# Altium project dory-x.PrjPcb (part 12 of 12)
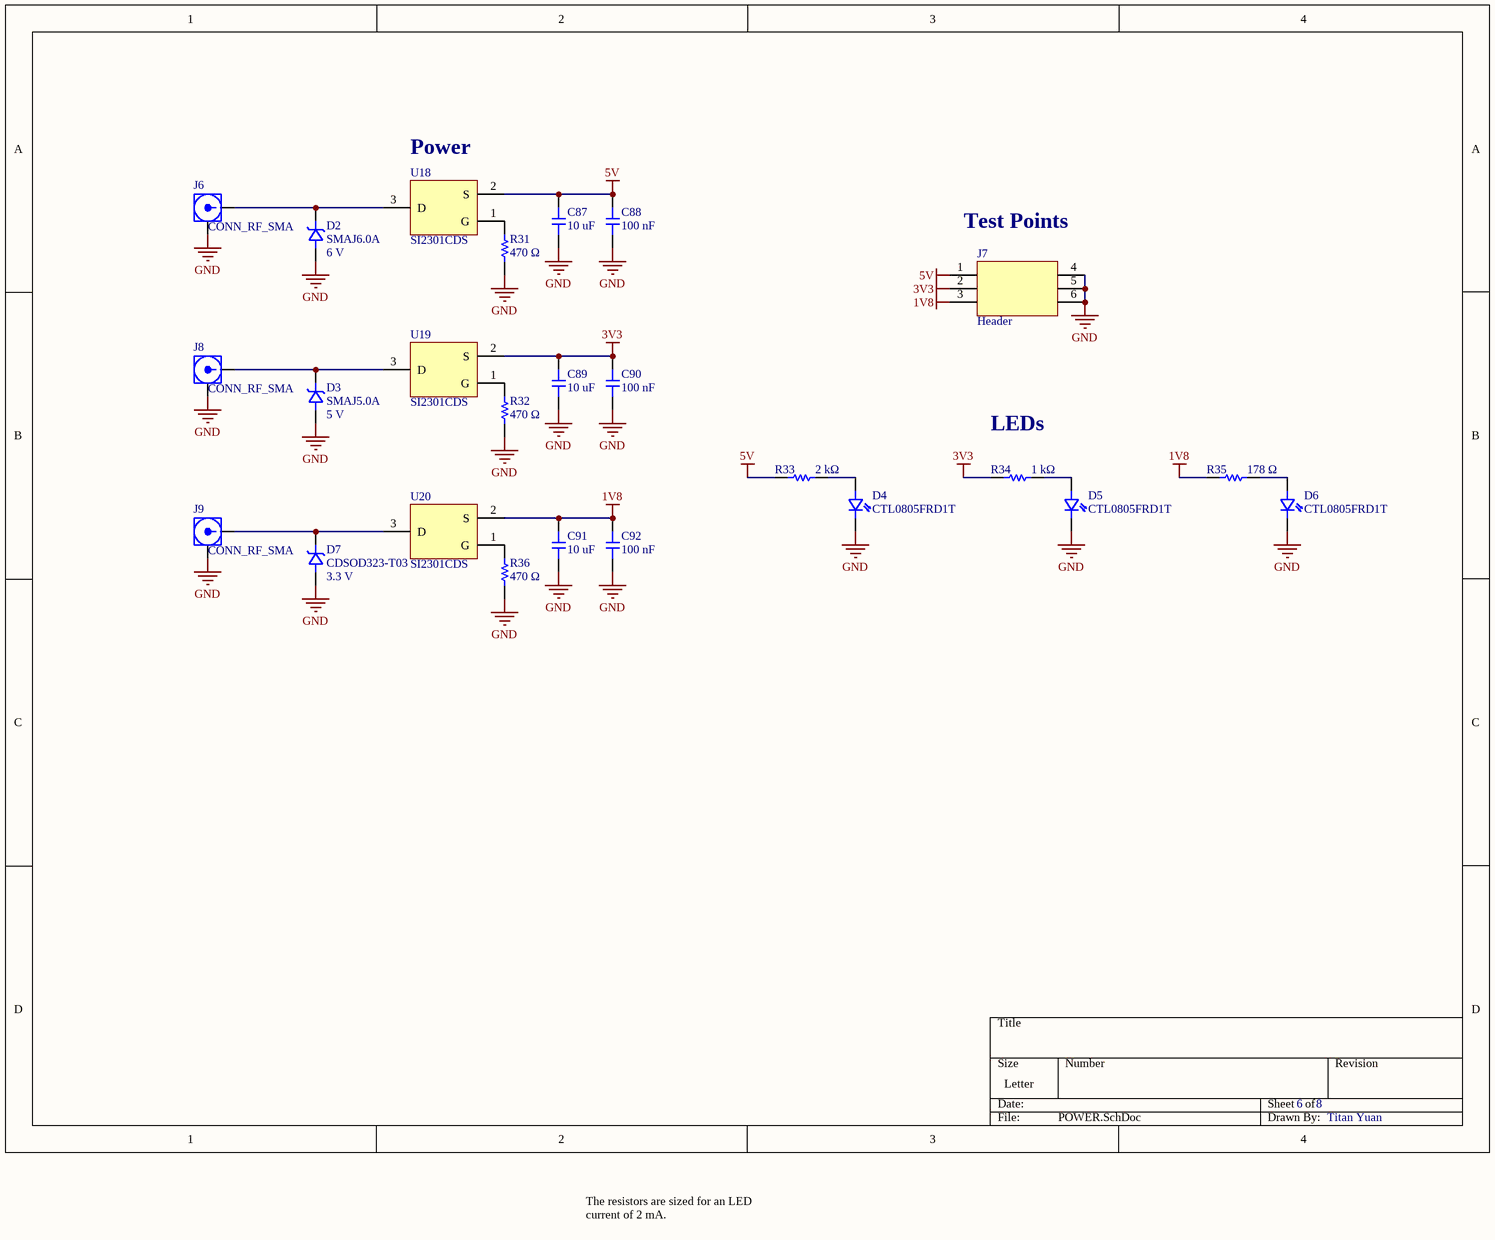
[diagram p18: POWER.SchDoc]

## Sheet POWER.SchDoc (continued)

### Library data of the parts (continued)
R35 = RES: Res Thick Film 0603 178 Ohm 1% 0.1W(1/10W) ±100ppm/C Pad SMD T/R; Manufacturer: Yageo; Manufacturer Part Number: RC0603FR-07178RL; Power Dissipation: 100mW; Value: 178Ω; Temperature Coefficient: 100ppm/°C; Voltage Rating: 75V; Voltage Rating (DC): 50V; Tolerance: 1%; Power Rating: *; Package Size: 0603; Supplier: DigiKey; Supplier Part Number: 311-178HRCT-ND; RoHS: Compliant; Category: Chip SMD Resistors; Stock: 269039; Pricing: 1=0.1, 10=0.006, 25=0.0056, 50=0.0052 (USD); Case/Package: 0603; Case Code (Imperial): 0603; China RoHS: Non-Compliant; Composition: Thick Film; Depth: 800µm; Height: 450µm; Lead Free: Lead Free; Length: 1.6mm; Lifecycle Status: Production; Max Operating Temperature: 155°C; Military Standard: Not; Min Operating Temperature: -55°C; Mounting Technology: Surface Mount; Number of Terminals: 2; Packaging: Tape & Reel; REACH SVHC: Yes; Schedule B: 8533210045, 8533210045|8533210045|8533210045|8533210045|8533210045; Termination: SMD/SMT; Width: 800µm; Working Voltage: 75V; ComponentLink1URL: https://datasheet.octopart.com:443/RC0603FR-07178RL-Yageo-datasheet-175887523.pdf?src-supplier=Newark; ComponentLink1Description: https://datasheet.octopart.com:443/RC0603FR-07178RL-Yageo-datasheet-175887523.pdf?src-supplier=Newark; ComponentLink2URL: https://datasheet.octopart.com:443/RC0603FR-07178RL-Yageo-datasheet-103092701.pdf?src-supplier=Upverter; ComponentLink2Description: https://datasheet.octopart.com:443/RC0603FR-07178RL-Yageo-datasheet-103092701.pdf?src-supplier=Upverter; ComponentLink3URL: https://datasheet.octopart.com:443/RC0603FR-07178RL-Yageo-Group-datasheet-176638170.pdf?src-supplier=Future+Electronics; ComponentLink3Description: https://datasheet.octopart.com:443/RC0603FR-07178RL-Yageo-Group-datasheet-176638170.pdf?src-supplier=Future+Electronics; ComponentLink4URL: https://datasheet.octopart.com:443/RC0603FR-07178RL-Yageo-datasheet-164759695.pdf?src-supplier=Future+Electronics; ComponentLink4Description: https://datasheet.octopart.com:443/RC0603FR-07178RL-Yageo-datasheet-164759695.pdf?src-supplier=Future+Electronics; ComponentLink5URL: https://datasheet.octopart.com:443/RC0603FR-07178RL-Yageo-datasheet-137700087.pdf?src-supplier=Future+Electronics; ComponentLink5Description: https://datasheet.octopart.com:443/RC0603FR-07178RL-Yageo-datasheet-137700087.pdf?src-supplier=Future+Electronics; ComponentLink6URL: https://datasheet.octopart.com:443/RC0603FR-07178RL-Yageo-datasheet-101672632.pdf?src-supplier=Future+Electronics; ComponentLink6Description: https://datasheet.octopart.com:443/RC0603FR-07178RL-Yageo-datasheet-101672632.pdf?src-supplier=Future+Electronics; ComponentLink7URL: https://datasheet.octopart.com:443/RC0603FR-07178RL-Yageo-datasheet-15599030.pdf?src-supplier=Future+Electronics; ComponentLink7Description: https://datasheet.octopart.com:443/RC0603FR-07178RL-Yageo-datasheet-15599030.pdf?src-supplier=Future+Electronics; ComponentLink8URL: https://datasheet.octopart.com:443/RC0603FR-07178RL-Yageo-datasheet-12596169.pdf?src-supplier=Future+Electronics; ComponentLink8Description: https://datasheet.octopart.com:443/RC0603FR-07178RL-Yageo-datasheet-12596169.pdf?src-supplier=Future+Electronics; ComponentLink9URL: https://datasheet.octopart.com:443/RC0603FR-07178RL-Yageo-datasheet-8328172.pdf?src-supplier=Future+Electronics; ComponentLink9Description: https://datasheet.octopart.com:443/RC0603FR-07178RL-Yageo-datasheet-8328172.pdf?src-supplier=Future+Electronics; ComponentLink10URL: https://datasheet.octopart.com:443/RC0603FR-07178RL-Yageo-datasheet-148775077.pdf?src-supplier=TME; ComponentLink10Description: https://datasheet.octopart.com:443/RC0603FR-07178RL-Yageo-datasheet-148775077.pdf?src-supplier=TME; ComponentLink11URL: https://datasheet.octopart.com/RC0603FR-07178RL-Yageo-datasheet-73766026.pdf; ComponentLink11Description: https://datasheet.octopart.com/RC0603FR-07178RL-Yageo-datasheet-73766026.pdf; ComponentLink12URL: https://datasheet.octopart.com:443/RC0603FR-07178RL-Yageo-datasheet-118562.pdf?src-supplier=DigiKey; ComponentLink12Description: https://datasheet.octopart.com:443/RC0603FR-07178RL-Yageo-datasheet-118562.pdf?src-supplier=DigiKey; ComponentLink13URL: http://sigma.octopart.com:80/conflict_mineral_statement/Yageo-company-3.pdf?src-supplier=Compliance+Statements; ComponentLink13Description: http://sigma.octopart.com:80/conflict_mineral_statement/Yageo-company-3.pdf?src-supplier=Compliance+Statements; ComponentLink14URL: http://sigma.octopart.com:80/rohs_statement/Yageo-company-2.pdf?src-supplier=Compliance+Statements; ComponentLink14Description: http://sigma.octopart.com:80/rohs_statement/Yageo-company-2.pdf?src-supplier=Compliance+Statements
U18-U20 = SI2301CDS: P-ch Mosfet SOT-23 20V 112MOHM @ 4.5V - Lead(pb) And Halogen Free; Manufacturer: Vishay Siliconix; Manufacturer Part Number: SI2301CDS-T1-GE3; Continuous Drain Current (ID): 3.1A; Drain to Source Breakdown Voltage: -20V; Drain to Source Resistance: 112mΩ; Element Configuration: Single; Fall Time: 35ns; Gate to Source Voltage (Vgs): 8V; Input Capacitance: 405pF; Max Junction Temperature (Tj): 150°C; Max Power Dissipation: 1.6W; Nominal Vgs: -400mV; Number of Channels: 1; Value: 112mΩ; Threshold Voltage: -1V; Turn-Off Delay Time: 30ns; Turn-On Delay Time: 11ns; Supplier: DigiKey; Supplier Part Number: SI2301CDS-T1-GE3CT-ND; RoHS: Compliant; Category: MOSFETs; Stock: 103168; Pricing: 1=0.69, 10=0.425, 100=0.2731, 500=0.20736, 1000=0.18615, 3000=0.15917, 6000=0.14558, 9000=0.13865, 15000=0.13086, 21000=0.12625, 30000=0.12177, 75000=0.11875 (USD); Case/Package: SOT-23; China RoHS: Compliant; Contact Plating: Tin; Country of Origin: Mainland China; Drain to Source Voltage (Vdss): -20V; Export Control Classification Number (ECCN) Code: EAR99; Height: 1.12mm; Introduction Date: 2008-07-29; Lead Free: Lead Free; Length: 3.04mm; Lifecycle Status: NRND; Max Operating Temperature: 150°C; Min Breakdown Voltage: 20V; Min Operating Temperature: -55°C; Mounting Technology: Surface Mount; Number of Elements: 1; Pins: 3; Number of Terminals: 3; Packaging: Cut Tape; Power Dissipation: 1.6W; Radiation Hardening: No; Rds On Max: 112mΩ; REACH SVHC: Yes; Rise Time: 35ns; Schedule B: 8541210080, 8541210080|8541210080, 8541210080|8541210080|8541210080, 8541210080|8541210080|8541210080|8541210080; Weight: 1.437803g; Width: 1.4mm; ComponentLink1URL: https://datasheet.octopart.com:443/SI2301CDS-T1-GE3-Vishay-datasheet-181471154.pdf?src-supplier=Newark; ComponentLink1Description: https://datasheet.octopart.com:443/SI2301CDS-T1-GE3-Vishay-datasheet-181471154.pdf?src-supplier=Newark; ComponentLink2URL: https://datasheet.octopart.com:443/SI2301CDS-T1-GE3-Vishay-datasheet-12510940.pdf?src-supplier=Newark; ComponentLink2Description: https://datasheet.octopart.com:443/SI2301CDS-T1-GE3-Vishay-datasheet-12510940.pdf?src-supplier=Newark; ComponentLink3URL: https://datasheet.octopart.com:443/SI2301CDS-T1-GE3-Vishay-datasheet-8434571.pdf?src-supplier=Newark; ComponentLink3Description: https://datasheet.octopart.com:443/SI2301CDS-T1-GE3-Vishay-datasheet-8434571.pdf?src-supplier=Newark; ComponentLink4URL: https://datasheet.octopart.com:443/SI2301CDS-T1-GE3-Vishay-datasheet-41341312.pdf?src-supplier=Newark; ComponentLink4Description: https://datasheet.octopart.com:443/SI2301CDS-T1-GE3-Vishay-datasheet-41341312.pdf?src-supplier=Newark; ComponentLink5URL: https://datasheet.octopart.com:443/SI2301CDS-T1-GE3-Vishay-datasheet-62318581.pdf?src-supplier=element14+APAC; ComponentLink5Description: https://datasheet.octopart.com:443/SI2301CDS-T1-GE3-Vishay-datasheet-62318581.pdf?src-supplier=element14+APAC; ComponentLink6URL: https://datasheet.octopart.com:443/SI2301CDS-T1-GE3-Vishay-datasheet-41195220.pdf?src-supplier=element14+APAC; ComponentLink6Description: https://datasheet.octopart.com:443/SI2301CDS-T1-GE3-Vishay-datasheet-41195220.pdf?src-supplier=element14+APAC; ComponentLink7URL: https://datasheet.octopart.com:443/SI2301CDS-T1-GE3.-Vishay-datasheet-78863653.pdf?src-supplier=element14+APAC; ComponentLink7Description: https://datasheet.octopart.com:443/SI2301CDS-T1-GE3.-Vishay-datasheet-78863653.pdf?src-supplier=element14+APAC; ComponentLink8URL: https://datasheet.octopart.com:443/SI2301CDS-T1-GE3-Vishay-datasheet-21269440.pdf?src-supplier=Farnell; ComponentLink8Description: https://datasheet.octopart.com:443/SI2301CDS-T1-GE3-Vishay-datasheet-21269440.pdf?src-supplier=Farnell; ComponentLink9URL: https://datasheet.octopart.com:443/SI2301CDS-T1-GE3-Vishay-datasheet-165585106.pdf?src-supplier=TME; ComponentLink9Description: https://datasheet.octopart.com:443/SI2301CDS-T1-GE3-Vishay-datasheet-165585106.pdf?src-supplier=TME; ComponentLink10URL: https://datasheet.octopart.com:443/SI2301CDS-T1-GE3-Vishay-datasheet-44060305.pdf?src-supplier=TME; ComponentLink10Description: https://datasheet.octopart.com:443/SI2301CDS-T1-GE3-Vishay-datasheet-44060305.pdf?src-supplier=TME; ComponentLink11URL: https://datasheet.octopart.com:443/SI2301CDS-T1-GE3-Vishay-Siliconix-datasheet-62309529.pdf?src-supplier=RS+(Formerly+Allied+Electronics); ComponentLink11Description: https://datasheet.octopart.com:443/SI2301CDS-T1-GE3-Vishay-Siliconix-datasheet-62309529.pdf?src-supplier=RS+(Formerly+Allied+Electronics); ComponentLink12URL: https://datasheet.octopart.com:443/SI2301CDS-T1-GE3-Vishay-datasheet-14188513.pdf?src-supplier=iiiC; ComponentLink12Description: https://datasheet.octopart.com:443/SI2301CDS-T1-GE3-Vishay-datasheet-14188513.pdf?src-supplier=iiiC; ComponentLink13URL: http://sigma.octopart.com:80/rohs_statement/Vishay-company-15.pdf?src-supplier=Compliance+Statements; ComponentLink13Description: http://sigma.octopart.com:80/rohs_statement/Vishay-company-15.pdf?src-supplier=Compliance+Statements

## Sheet MCU.SchDoc
size Letter; DrawnBy: Titan Yuan; SheetNumber: 7; SheetTotal: 8
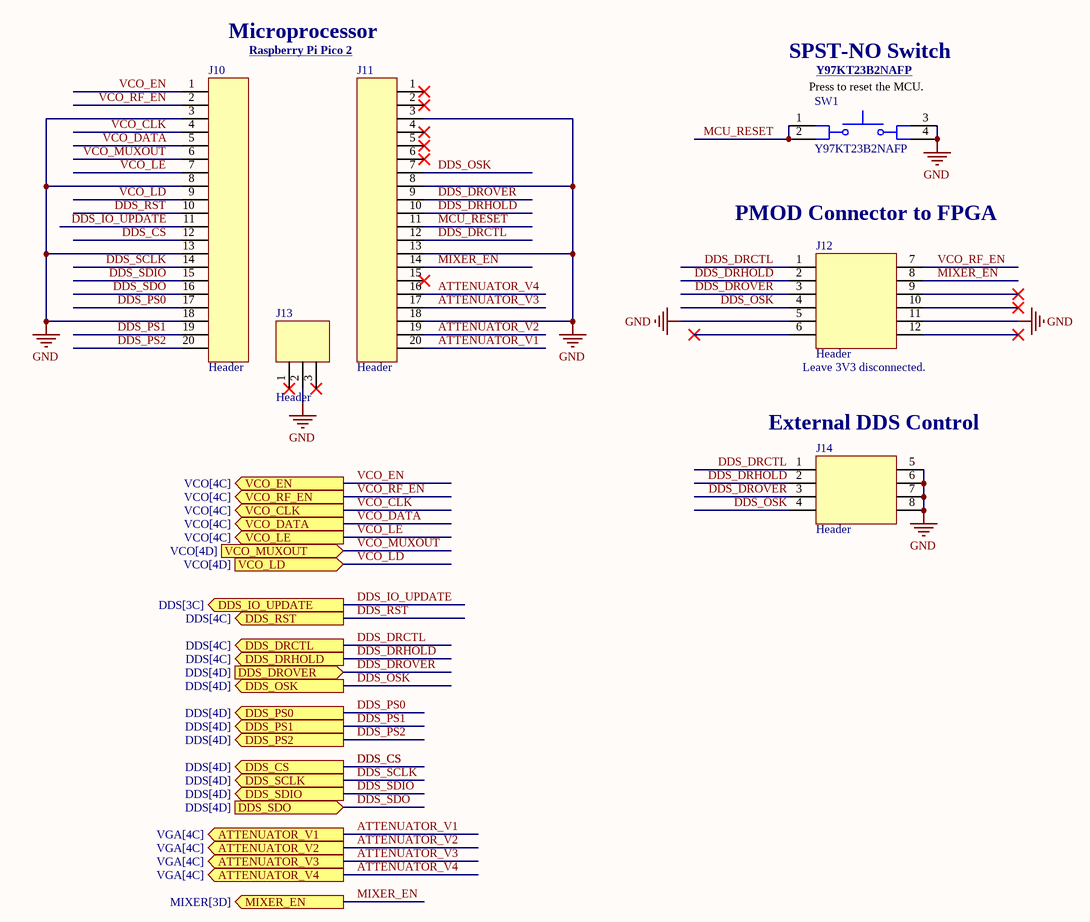
[diagram p6: MCU.SchDoc]

### Parts
J10  Header  [CONN_1x20_2.54mm_PinSocket_Vertical]
J11  Header  [CONN_1x20_2.54mm_PinSocket_Vertical]
J12  Header  [CONN_2x6_2.54mm_PinHeader_Horizontal]
J13  Header  [CONN_1x3_2.54mm_PinSocket_Vertical]
J14  Header  [CONN_2x4_2.54mm_PinHeader_Vertical]
SW1  Y97KT23B2NAFP  [PTS647]

### Ports
ATTENUATOR_V1 (out, see VGA[4C]), ATTENUATOR_V2 (out, see VGA[4C]), ATTENUATOR_V3 (out, see VGA[4C]), ATTENUATOR_V4 (out, see VGA[4C]), DDS_CS (out, see DDS[4D]), DDS_DRCTL (out, see DDS[4C]), DDS_DRHOLD (out, see DDS[4C]), DDS_DROVER (in, see DDS[4D]), DDS_IO_UPDATE (out, see DDS[3C]), DDS_OSK (out, see DDS[4D]), DDS_PS0 (out, see DDS[4D]), DDS_PS1 (out, see DDS[4D]), DDS_PS2 (out, see DDS[4D]), DDS_RST (out, see DDS[4C]), DDS_SCLK (out, see DDS[4D]), DDS_SDIO (out, see DDS[4D]), DDS_SDO (in, see DDS[4D]), MIXER_EN (out, see MIXER[3D]), VCO_CLK (out, see VCO[4C]), VCO_DATA (out, see VCO[4C]), VCO_EN (out, see VCO[4C]), VCO_LD (in, see VCO[4D]), VCO_LE (out, see VCO[4C]), VCO_MUXOUT (in, see VCO[4D]), VCO_RF_EN (out, see VCO[4C])

### Nets
GND: J10.3 J10.8 J10.13 J10.18 J11.3 J11.8 J11.13 J11.18 J12.5 J12.11 J13.2 J14.5 J14.6 J14.7 J14.8 SW1.3 SW1.4
ATTENUATOR_V1: J11.20 ; port ATTENUATOR_V1
ATTENUATOR_V2: J11.19 ; port ATTENUATOR_V2
ATTENUATOR_V3: J11.17 ; port ATTENUATOR_V3
ATTENUATOR_V4: J11.16 ; port ATTENUATOR_V4
DDS_CS: J10.12 ; port DDS_CS
DDS_DRCTL: J11.12 J12.1 J14.1 ; port DDS_DRCTL
DDS_DRHOLD: J11.10 J12.2 J14.2 ; port DDS_DRHOLD
DDS_DROVER: J11.9 J12.3 J14.3 ; port DDS_DROVER
DDS_IO_UPDATE: J10.11 ; port DDS_IO_UPDATE
DDS_OSK: J11.7 J12.4 J14.4 ; port DDS_OSK
DDS_PS0: J10.17 ; port DDS_PS0
DDS_PS1: J10.19 ; port DDS_PS1
DDS_PS2: J10.20 ; port DDS_PS2
DDS_RST: J10.10 ; port DDS_RST
DDS_SCLK: J10.14 ; port DDS_SCLK
DDS_SDIO: J10.15 ; port DDS_SDIO
DDS_SDO: J10.16 ; port DDS_SDO
MCU_RESET: J11.11 SW1.1 SW1.2  [project net MCU_RESET_7]
MIXER_EN: J11.14 J12.8 ; port MIXER_EN
VCO_CLK: J10.4 ; port VCO_CLK
VCO_DATA: J10.5 ; port VCO_DATA
VCO_EN: J10.1 ; port VCO_EN
VCO_LD: J10.9 ; port VCO_LD
VCO_LE: J10.7 ; port VCO_LE
VCO_MUXOUT: J10.6 ; port VCO_MUXOUT
VCO_RF_EN: J10.2 J12.7 ; port VCO_RF_EN

Not connected (* = marked no-connect by the designer): J11 1* 2* 4* 5* 6* 15*; J12 6* 9* 10* 12*; J13 1* 3*

### Notes on the sheet
- Microprocessor
- Raspberry Pi Pico 2 <https://www.raspberrypi.com/products/raspberry-pi-pico-2/>
- SPST-NO Switch
- (near SW1) Press to reset the MCU.
- (near SW1) Y97KT23B2NAFP <https://www.ckswitches.com/media/2567/pts647.pdf>
- PMOD Connector to FPGA
- (near J12) Leave 3V3 disconnected.
- (near J14) External DDS Control

### Library data of the parts
J10 J11 = CONN_1x20_2.54mm_PinSocket_Vertical: WR-PHD 2.54 mm Socket Header; 20 pins; Manufacturer: Wurth Elektronik; Manufacturer Part Number: 61302011821; Contact Resistance: 20mΩ; Current Rating: 3A; Gender: Female; Insulation Resistance: 1GΩ; Operating Supply Voltage: 250V; Pitch: 2.54mm; Supplier: DigiKey; Supplier Part Number: 732-61302011821-ND; RoHS: Compliant; Category: Connectors; Stock: 9205; Pricing: 1=0.83, 25=0.7508, 100=0.7038, 250=0.6534, 500=0.6048, 1000=0.5058 (USD); Contact Plating: Gold; Insulation Material: PBT; Lead Pitch: 2.54mm; Length: 51.3mm; Max Operating Temperature: 105°C; Min Operating Temperature: -40°C; Pins: 20; Orientation: Vertical; ComponentLink1URL: https://datasheet.octopart.com:443/61302011821-Wurth-Elektronik-datasheet-182028588.pdf?src-supplier=Wurth+Elektronik; ComponentLink1Description: https://datasheet.octopart.com:443/61302011821-Wurth-Elektronik-datasheet-182028588.pdf?src-supplier=Wurth+Elektronik; ComponentLink2URL: https://datasheet.octopart.com:443/61302011821-W%C3%BCrth-Elektronik-datasheet-62127820.pdf?src-supplier=Wurth+Elektronik; ComponentLink2Description: https://datasheet.octopart.com:443/61302011821-W%C3%BCrth-Elektronik-datasheet-62127820.pdf?src-supplier=Wurth+Elektronik; ComponentLink3URL: https://datasheet.octopart.com:443/61302011821-W%C3%BCrth-Elektronik-datasheet-149524182.pdf?src-supplier=Farnell; ComponentLink3Description: https://datasheet.octopart.com:443/61302011821-W%C3%BCrth-Elektronik-datasheet-149524182.pdf?src-supplier=Farnell
J12 = CONN_2x6_2.54mm_PinHeader_Horizontal: Conn Unshrouded Header HDR 12 POS 2.54mm Solder RA Top Entry Thru-Hole Bag; Manufacturer: Adam Tech; Manufacturer Part Number: PH2RA-12-UA; Contact Resistance: 20mΩ; Current Rating: 3A; Insulation Resistance: 5GΩ; Supplier: DigiKey; Supplier Part Number: 2057-PH2RA-12-UA-ND; RoHS: Compliant; Category: Card Edge Connectors; Stock: 5214; Pricing: 1=0.27, 10=0.229, 100=0.1945, 500=0.17358, 1000=0.16528, 5000=0.14753, 10000=0.14049 (USD); Contact Gender: Male; Contact Material: Brass; Export Control Classification Number (ECCN) Code: EAR99; Harmonized Tariff Schedule (HTS) Code: 8536.69.40.40; Introduction Date: 2012-01-13; Lifecycle Status: Production; Max Operating Temperature: 105°C; Min Operating Temperature: -40°C; Pins: 12; Number of Rows: 2; REACH SVHC: Yes; Row Spacing: 2.54mm; Schedule B: 8536694040, 8536694040|8536694040|8536694040|8536694040|8536694040; Terminal Pitch: 2.54mm; ComponentLink1URL: https://datasheet.octopart.com:443/PH2RA-12-UA-Adam-Tech-datasheet-21182894.pdf?src-supplier=IHS; ComponentLink1Description: https://datasheet.octopart.com:443/PH2RA-12-UA-Adam-Tech-datasheet-21182894.pdf?src-supplier=IHS; ComponentLink2URL: http://sigma.octopart.com:80/reach_statement/Adam-Tech-company-23.pdf?src-supplier=Compliance+Statements; ComponentLink2Description: http://sigma.octopart.com:80/reach_statement/Adam-Tech-company-23.pdf?src-supplier=Compliance+Statements; ComponentLink3URL: http://sigma.octopart.com:80/rohs_statement/Adam-Tech-company-22.pdf?src-supplier=Compliance+Statements; ComponentLink3Description: http://sigma.octopart.com:80/rohs_statement/Adam-Tech-company-22.pdf?src-supplier=Compliance+Statements
J13 = CONN_1x3_2.54mm_PinSocket_Vertical: Connector Header Through Hole 3 position 0.100" (2.54mm)-FAN Control Connector; Manufacturer: Wurth Elektronik; Manufacturer Part Number: 61300311821; Manufacturer Lifecycle Status: ACTIVE; Contact Resistance: 20mΩ; Current Rating: 3A; Gender: Female; Insulation Resistance: 1GΩ; Operating Supply Voltage: 250V; YEOL: 1 = Estimated lifetime > 10 years; Supplier: DigiKey; Supplier Part Number: 732-61300311821-ND; RoHS: Compliant; Category: Uncategorized; Stock: 1715; Pricing: 1=0.32, 10=0.303, 100=0.2916, 250=0.27992, 500=0.2673 (USD); Contact Plating: Gold; Insulation Material: PBT; Lead Pitch: 2.54mm; Length: 8.12mm; Max Operating Temperature: 105°C; Min Operating Temperature: -40°C; Pins: 3; Orientation: Vertical; Pitch: 2.54mm; ComponentLink1URL: https://datasheet.octopart.com:443/61300311821-Wurth-Elektronik-datasheet-182028583.pdf?src-supplier=Wurth+Elektronik; ComponentLink1Description: https://datasheet.octopart.com:443/61300311821-Wurth-Elektronik-datasheet-182028583.pdf?src-supplier=Wurth+Elektronik; ComponentLink2URL: https://datasheet.octopart.com:443/61300311821-W%C3%BCrth-Elektronik-datasheet-62127820.pdf?src-supplier=Wurth+Elektronik; ComponentLink2Description: https://datasheet.octopart.com:443/61300311821-W%C3%BCrth-Elektronik-datasheet-62127820.pdf?src-supplier=Wurth+Elektronik; Lifecycle Status: Production
J14 = CONN_2x4_2.54mm_PinHeader_Vertical: Pin Header, Board-to-Board, 2.54 mm, 2 Rows, 8 Contacts, Through Hole, TSW Series; Manufacturer: Samtec; Manufacturer Part Number: TSW-104-07-F-D; Manufacturer Lifecycle Status: PRODUCTION; Connector Type: Male Pin; Gender: Male; Max Current Rating: 7.6A; Max Voltage Rating (AC): 550V; Number of Contacts: 8; Pitch: 2.54mm; Supplier: DigiKey; Supplier Part Number: SAM8996-ND; RoHS: Compliant; Category: Headers and Wire Housings; Stock: 16994; Pricing: 1=0.43, 250=0.37, 500=0.308, 1000=0.263, 2500=0.218, 5000=0.19, 10000=0.167, 25000=0.146 (USD); Color: Black; Contact Material: Bronze; Contact Mating Length: 5.842mm; Contact Plating: Gold; Depth: 5.08mm; Housing Color: Black; Housing Material: Polyester; Lead Pitch: 2.54mm; Length: 10.16mm; Lifecycle Status: Production; Max Operating Temperature: 125°C; Min Operating Temperature: -55°C; Mounting Technology: Through Hole; Number of Positions: 8; Number of Rows: 2; Orientation: Straight; Radiation Hardening: No; REACH SVHC: No; Row Spacing: 2.54mm; Termination: Solder; ComponentLink1URL: https://datasheet.octopart.com:443/TSW-104-07-F-D-Samtec-datasheet-97325576.pdf?src-supplier=Sager+Electronics; ComponentLink1Description: https://datasheet.octopart.com:443/TSW-104-07-F-D-Samtec-datasheet-97325576.pdf?src-supplier=Sager+Electronics; ComponentLink2URL: https://datasheet.octopart.com:443/TSW-104-07-F-D-Samtec-datasheet-151455181.pdf?src-supplier=Sager+Electronics; ComponentLink2Description: https://datasheet.octopart.com:443/TSW-104-07-F-D-Samtec-datasheet-151455181.pdf?src-supplier=Sager+Electronics; ComponentLink3URL: https://sigma.octopart.com:443/97325577/technical_drawing/Samtec-TSW-104-07-F-D.pdf?src-supplier=HQonline; ComponentLink3Description: https://sigma.octopart.com:443/97325577/technical_drawing/Samtec-TSW-104-07-F-D.pdf?src-supplier=HQonline; ComponentLink4URL: https://datasheet.octopart.com:443/TSW-104-07-F-D-Samtec-datasheet-136646178.pdf?src-supplier=Master+Electronics; ComponentLink4Description: https://datasheet.octopart.com:443/TSW-104-07-F-D-Samtec-datasheet-136646178.pdf?src-supplier=Master+Electronics; ComponentLink5URL: https://datasheet.octopart.com:443/TSW-104-07-F-D-Samtec-datasheet-182948906.pdf?src-supplier=JRH+Electronics; ComponentLink5Description: https://datasheet.octopart.com:443/TSW-104-07-F-D-Samtec-datasheet-182948906.pdf?src-supplier=JRH+Electronics; ComponentLink6URL: https://datasheet.octopart.com:443/TSW-104-07-F-D-Samtec-datasheet-160657603.pdf?src-supplier=Toby+Electronics; ComponentLink6Description: https://datasheet.octopart.com:443/TSW-104-07-F-D-Samtec-datasheet-160657603.pdf?src-supplier=Toby+Electronics; ComponentLink7URL: https://datasheet.octopart.com:443/TSW-104-07-F-D-Samtec-datasheet-116539033.pdf?src-supplier=Toby+Electronics; ComponentLink7Description: https://datasheet.octopart.com:443/TSW-104-07-F-D-Samtec-datasheet-116539033.pdf?src-supplier=Toby+Electronics; ComponentLink8URL: https://datasheet.octopart.com:443/TSW-104-07-F-D-Samtec-datasheet-116536310.pdf?src-supplier=Toby+Electronics; ComponentLink8Description: https://datasheet.octopart.com:443/TSW-104-07-F-D-Samtec-datasheet-116536310.pdf?src-supplier=Toby+Electronics; ComponentLink9URL: https://datasheet.octopart.com:443/TSW-104-07-F-D-Samtec-datasheet-116615235.pdf?src-supplier=Electro+Sonic; ComponentLink9Description: https://datasheet.octopart.com:443/TSW-104-07-F-D-Samtec-datasheet-116615235.pdf?src-supplier=Electro+Sonic; ComponentLink10URL: https://datasheet.octopart.com/TSW-104-07-F-D-Samtec-datasheet-86818365.pdf; ComponentLink10Description: https://datasheet.octopart.com/TSW-104-07-F-D-Samtec-datasheet-86818365.pdf; ComponentLink11URL: https://datasheet.octopart.com:443/TSW-104-07-F-D-Samtec-datasheet-62107121.pdf?src-supplier=Newark; ComponentLink11Description: https://datasheet.octopart.com:443/TSW-104-07-F-D-Samtec-datasheet-62107121.pdf?src-supplier=Newark; ComponentLink12URL: https://datasheet.octopart.com:443/TSW-104-07-F-D-Samtec-datasheet-11047283.pdf?src-supplier=Newark; ComponentLink12Description: https://datasheet.octopart.com:443/TSW-104-07-F-D-Samtec-datasheet-11047283.pdf?src-supplier=Newark
SW1 = Y97KT23B2NAFP: Switch Tactile OFF Mom SPST Round Button Gull Wing 50mA 12VDC 100000Cycles 1.77N Surface Mount T/R; Manufacturer: C&K; Bounce Time: <=5 ms; Contact Resistance: 100 mΩ; Electrical Life: 100kcycles; Max Voltage Rating (DC): 12V; Number of Positions: 1; Operating Force: 2.26N; Manufacturer Part Number: Y97KT23B2NAFP; Maximum Voltage: 12 VDC; Maximum Current: 50 mA; Insulation Resistance: 100 MΩ; Supplier: DigiKey; Supplier Part Number: 108-PTS647SM38SMTR2LFSCT-ND; RoHS: Compliant; Category: Tactile Switches; Stock: 37245; Pricing: 1=0.26, 10=0.226, 25=0.2116, 100=0.1897, 250=0.17588, 500=0.16596, 1000=0.15666 (USD); Contact Current Rating: 50mA; Country of Origin: Mainland China; Export Control Classification Number (ECCN) Code: EAR99; Height: 2.9mm; Harmonized Tariff Schedule (HTS) Code: 8536.50.90.40; Introduction Date: 2019-06-11; Length: 4.5mm; Life (Cycles): 100kcycles; Lifecycle Status: Production; Max Current Rating: 50mA; Max Operating Temperature: 70°C; Min Operating Temperature: -40°C; Mounting Technology: Surface Mount; REACH SVHC: Yes; Schedule B: 8536509065, 8536509065|8536509065, 8536509065|8536509065|8536509065, 8536509065|8536509065|8536509065|8536509065; Throw Configuration: SPST; Voltage Rating (DC): 12V; ComponentLink1URL: https://datasheet.octopart.com:443/PTS647SM38SMTR2LFS-C%26K-Components-datasheet-180017464.pdf?src-supplier=IHS; ComponentLink1Description: https://datasheet.octopart.com:443/PTS647SM38SMTR2LFS-C%26K-Components-datasheet-180017464.pdf?src-supplier=IHS; ComponentLink2URL: https://datasheet.octopart.com:443/PTS647SM38SMTR2LFS-C%26K-Components-datasheet-117317067.pdf?src-supplier=Future+Electronics; ComponentLink2Description: https://datasheet.octopart.com:443/PTS647SM38SMTR2LFS-C%26K-Components-datasheet-117317067.pdf?src-supplier=Future+Electronics; ComponentLink3URL: https://datasheet.octopart.com:443/PTS647SM38SMTR2-LFS-C%26K-Components-datasheet-175422368.pdf?src-supplier=Farnell; ComponentLink3Description: https://datasheet.octopart.com:443/PTS647SM38SMTR2-LFS-C%26K-Components-datasheet-175422368.pdf?src-supplier=Farnell; ComponentLink4URL: https://datasheet.octopart.com:443/PTS647SM38SMTR2LFS-C%26K-Components-datasheet-145017121.pdf?src-supplier=Electro+Sonic; ComponentLink4Description: https://datasheet.octopart.com:443/PTS647SM38SMTR2LFS-C%26K-Components-datasheet-145017121.pdf?src-supplier=Electro+Sonic; ComponentLink5URL: https://datasheet.octopart.com:443/PTS-647-SM38-SMTR2-LFS-C%26K-Components-datasheet-119449707.pdf?src-supplier=RS+(Formerly+Allied+Electronics); ComponentLink5Description: https://datasheet.octopart.com:443/PTS-647-SM38-SMTR2-LFS-C%26K-Components-datasheet-119449707.pdf?src-supplier=RS+(Formerly+Allied+Electronics)

## Sheet DEBUG.SchDoc
size Letter; DrawnBy: Titan Yuan; SheetNumber: 8; SheetTotal: 8
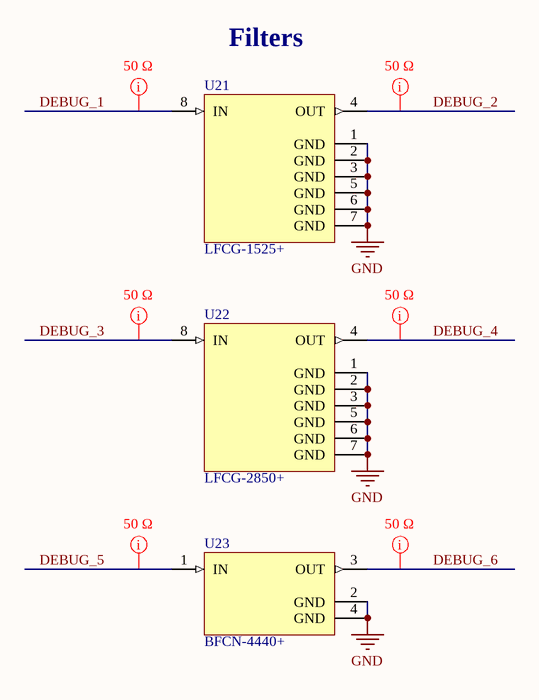
[diagram p7: DEBUG.SchDoc]

### Parts
U21  LFCG-1525+  [PL-429]
U22  LFCG-2850+  [PL-429]
U23  BFCN-4440+  [FV1206]

### Nets
GND: U21.1(GND) U21.2(GND) U21.3(GND) U21.5(GND) U21.6(GND) U21.7(GND) U22.1(GND) U22.2(GND) U22.3(GND) U22.5(GND) U22.6(GND) U22.7(GND) U23.2(GND) U23.4(GND)
DEBUG_1: U21.8(IN)  [project net DEBUG_1_8]
DEBUG_2: U21.4(OUT)  [project net DEBUG_2_8]
DEBUG_3: U22.8(IN)  [project net DEBUG_3_8]
DEBUG_4: U22.4(OUT)  [project net DEBUG_4_8]
DEBUG_5: U23.1(IN)  [project net DEBUG_5_8]
DEBUG_6: U23.3(OUT)  [project net DEBUG_6_8]

### Layout directives
net class 50 Ω: DEBUG_1_8, DEBUG_2_8, DEBUG_3_8, DEBUG_4_8, DEBUG_5_8, DEBUG_6_8

### Notes on the sheet
- (near U21) Filters

### Library data of the parts
U21 = LFCG-1525+: Ceramic LPF, 1 Section(s) Min, 1 Section(s) Max; Manufacturer: Mini-Circuits; Cutoff Frequency: 1.525GHz; Manufacturer Part Number: LFCG-1525+; Supplier: DigiKey; Supplier Part Number: 3157-LFCG-1525+CT-ND; RoHS: Compliant; Category: Ceramic Filters; Stock: 1035; Pricing: 1=13.73, 20=6.696, 50=6.42, 100=6, 200=5.448, 500=4.896, 1000=4.092, 2000=3.8556 (USD); Introduction Date: 2020-08-28; Lifecycle Status: Production; ComponentLink1URL: https://datasheet.octopart.com:443/LFCG-1525%2B-Mini-Circuits-datasheet-180701239.pdf?src-supplier=IHS; ComponentLink1Description: https://datasheet.octopart.com:443/LFCG-1525%2B-Mini-Circuits-datasheet-180701239.pdf?src-supplier=IHS
U22 = LFCG-2850+: 1.8dB 50Ω 2.85GHz 0805 SMD mount 2mm*1.25mm*950μm; Manufacturer: Mini-Circuits; Cutoff Frequency: 3.25GHz; Manufacturer Part Number: LFCG-2850+; Supplier: DigiKey; Supplier Part Number: 3157-LFCG-2850+CT-ND; RoHS: Compliant; Category: Ceramic Filters; Stock: 1260; Pricing: 1=14.41, 20=7.032, 50=6.744, 100=6.3, 200=5.724, 500=5.136 (USD); Export Control Classification Number (ECCN) Code: EAR99; Height: 950µm; Insertion Loss (dB): 1.8dB; Introduction Date: 2018-10-03; Length: 2mm; Lifecycle Status: Production; Max Operating Temperature: 85°C; Min Operating Temperature: -40°C; Mounting Technology: Surface Mount; REACH SVHC: Yes; Width: 1.25mm; ComponentLink1URL: https://datasheet.octopart.com:443/LFCG-2850%2B-Mini-Circuits-datasheet-180701242.pdf?src-supplier=IHS; ComponentLink1Description: https://datasheet.octopart.com:443/LFCG-2850%2B-Mini-Circuits-datasheet-180701242.pdf?src-supplier=IHS
U23 = BFCN-4440+: Ceramic BPF, 1 Section(s) Min, 1 Section(s) Max, 4440MHz; Manufacturer: Mini-Circuits; Cutoff Frequency: 4.44GHz; Insertion Loss (dB): 2dB; Manufacturer Part Number: BFCN-4440+; Supplier: DigiKey; Supplier Part Number: 3157-BFCN-4440+CT-ND; RoHS: Compliant; Category: Ceramic Filters; Stock: 3974; Pricing: 1=14.95, 20=6.6, 50=6.3, 100=5.988, 200=5.29205, 500=5.13602, 1000=5.1255 (USD); Export Control Classification Number (ECCN) Code: EAR99; Height: 940µm; Introduction Date: 2008-02-14; Length: 3.2mm; Lifecycle Status: Production; Max Operating Temperature: 100°C; Min Operating Temperature: -55°C; REACH SVHC: Yes; Width: 1.6mm; ComponentLink1URL: https://datasheet.octopart.com:443/BFCN-4440%2B-Mini-Circuits-datasheet-62330094.pdf?src-supplier=Component+Distributors+Inc.; ComponentLink1Description: https://datasheet.octopart.com:443/BFCN-4440%2B-Mini-Circuits-datasheet-62330094.pdf?src-supplier=Component+Distributors+Inc.

## Nets that join several sheets
1V8: DDS (16 pins), POWER (5 pins)
3V3: VCO (24 pins), DDS (30 pins), POWER (5 pins)
5V: MIXER (C62.2 C63.2 U11.6 U11.7), VGA (5 pins), DOUBLER (6 pins), POWER (5 pins)
GND: VCO (35 pins), DDS (89 pins), MIXER (19 pins), VGA (21 pins), DOUBLER (29 pins), POWER (21 pins), MCU (17 pins), DEBUG (14 pins)
ATTENUATOR_V1: VGA (U13.13), MCU (J11.20)
ATTENUATOR_V2: VGA (U13.14), MCU (J11.19)
ATTENUATOR_V3: VGA (U13.15), MCU (J11.17)
ATTENUATOR_V4: VGA (U13.16), MCU (J11.16)
DDS_CS: DDS (R16.2 U3.22), MCU (J10.12)
DDS_DRCTL: DDS (U3.63), MCU (J11.12 J12.1 J14.1)
DDS_DRHOLD: DDS (U3.64), MCU (J11.10 J12.2 J14.2)
DDS_DROVER: DDS (U3.65), MCU (J11.9 J12.3 J14.3)
DDS_IO_UPDATE: DDS (R15.2 U3.86), MCU (J10.11)
DDS_OSK: DDS (R18.2 U3.66), MCU (J11.7 J12.4 J14.4)
DDS_OUT_N: DDS (U9.4), MIXER (C60.1)
DDS_OUT_P: DDS (U6.4), MIXER (C61.1)
DDS_PS0: DDS (U3.25), MCU (J10.17)
DDS_PS1: DDS (U3.26), MCU (J10.19)
DDS_PS2: DDS (U3.27), MCU (J10.20)
DDS_RST: DDS (R17.2 U3.85), MCU (J10.10)
DDS_SCLK: DDS (U3.21), MCU (J10.14)
DDS_SDIO: DDS (U3.20), MCU (J10.15)
DDS_SDO: DDS (U3.19), MCU (J10.16)
MIXER_EN: MIXER (R25.2 U11.5), MCU (J11.14 J12.8)
MIXER_OUT: MIXER (U12.3), VGA (C64.2)
VCO_CLK: VCO (U1.1), MCU (J10.4)
VCO_DATA: VCO (U1.2), MCU (J10.5)
VCO_EN: VCO (R1.2 U1.4), MCU (J10.1)
VCO_LD: VCO (U1.25), MCU (J10.9)
VCO_LE: VCO (R2.2 U1.3), MCU (J10.7)
VCO_MUXOUT: VCO (U1.30), MCU (J10.6)
VCO_RF_EN: VCO (R3.2 U1.26), MCU (J10.2 J12.7)
VCO_RFOUTA_N: VCO (L2.1 U1.13), DDS (C52.2 R21.1)
VCO_RFOUTA_P: VCO (L1.1 U1.12), DDS (C49.2 R21.2)
VCO_RFOUTB_N: VCO (L4.1 U1.15), MIXER (C55.2)
VCO_RFOUTB_P: VCO (L3.1 U1.14), MIXER (C57.2)
VGA_OUT: VGA (C71.1), DOUBLER (R27.1)